# Altium schematic sheet Sheet.SchDoc
size A2 portrait; Organization: Altium Limited; Address1: L3, 12a Rodborough Rd; Address2: Frenchs Forest; Address3: NSW; Address4: Australia 2086
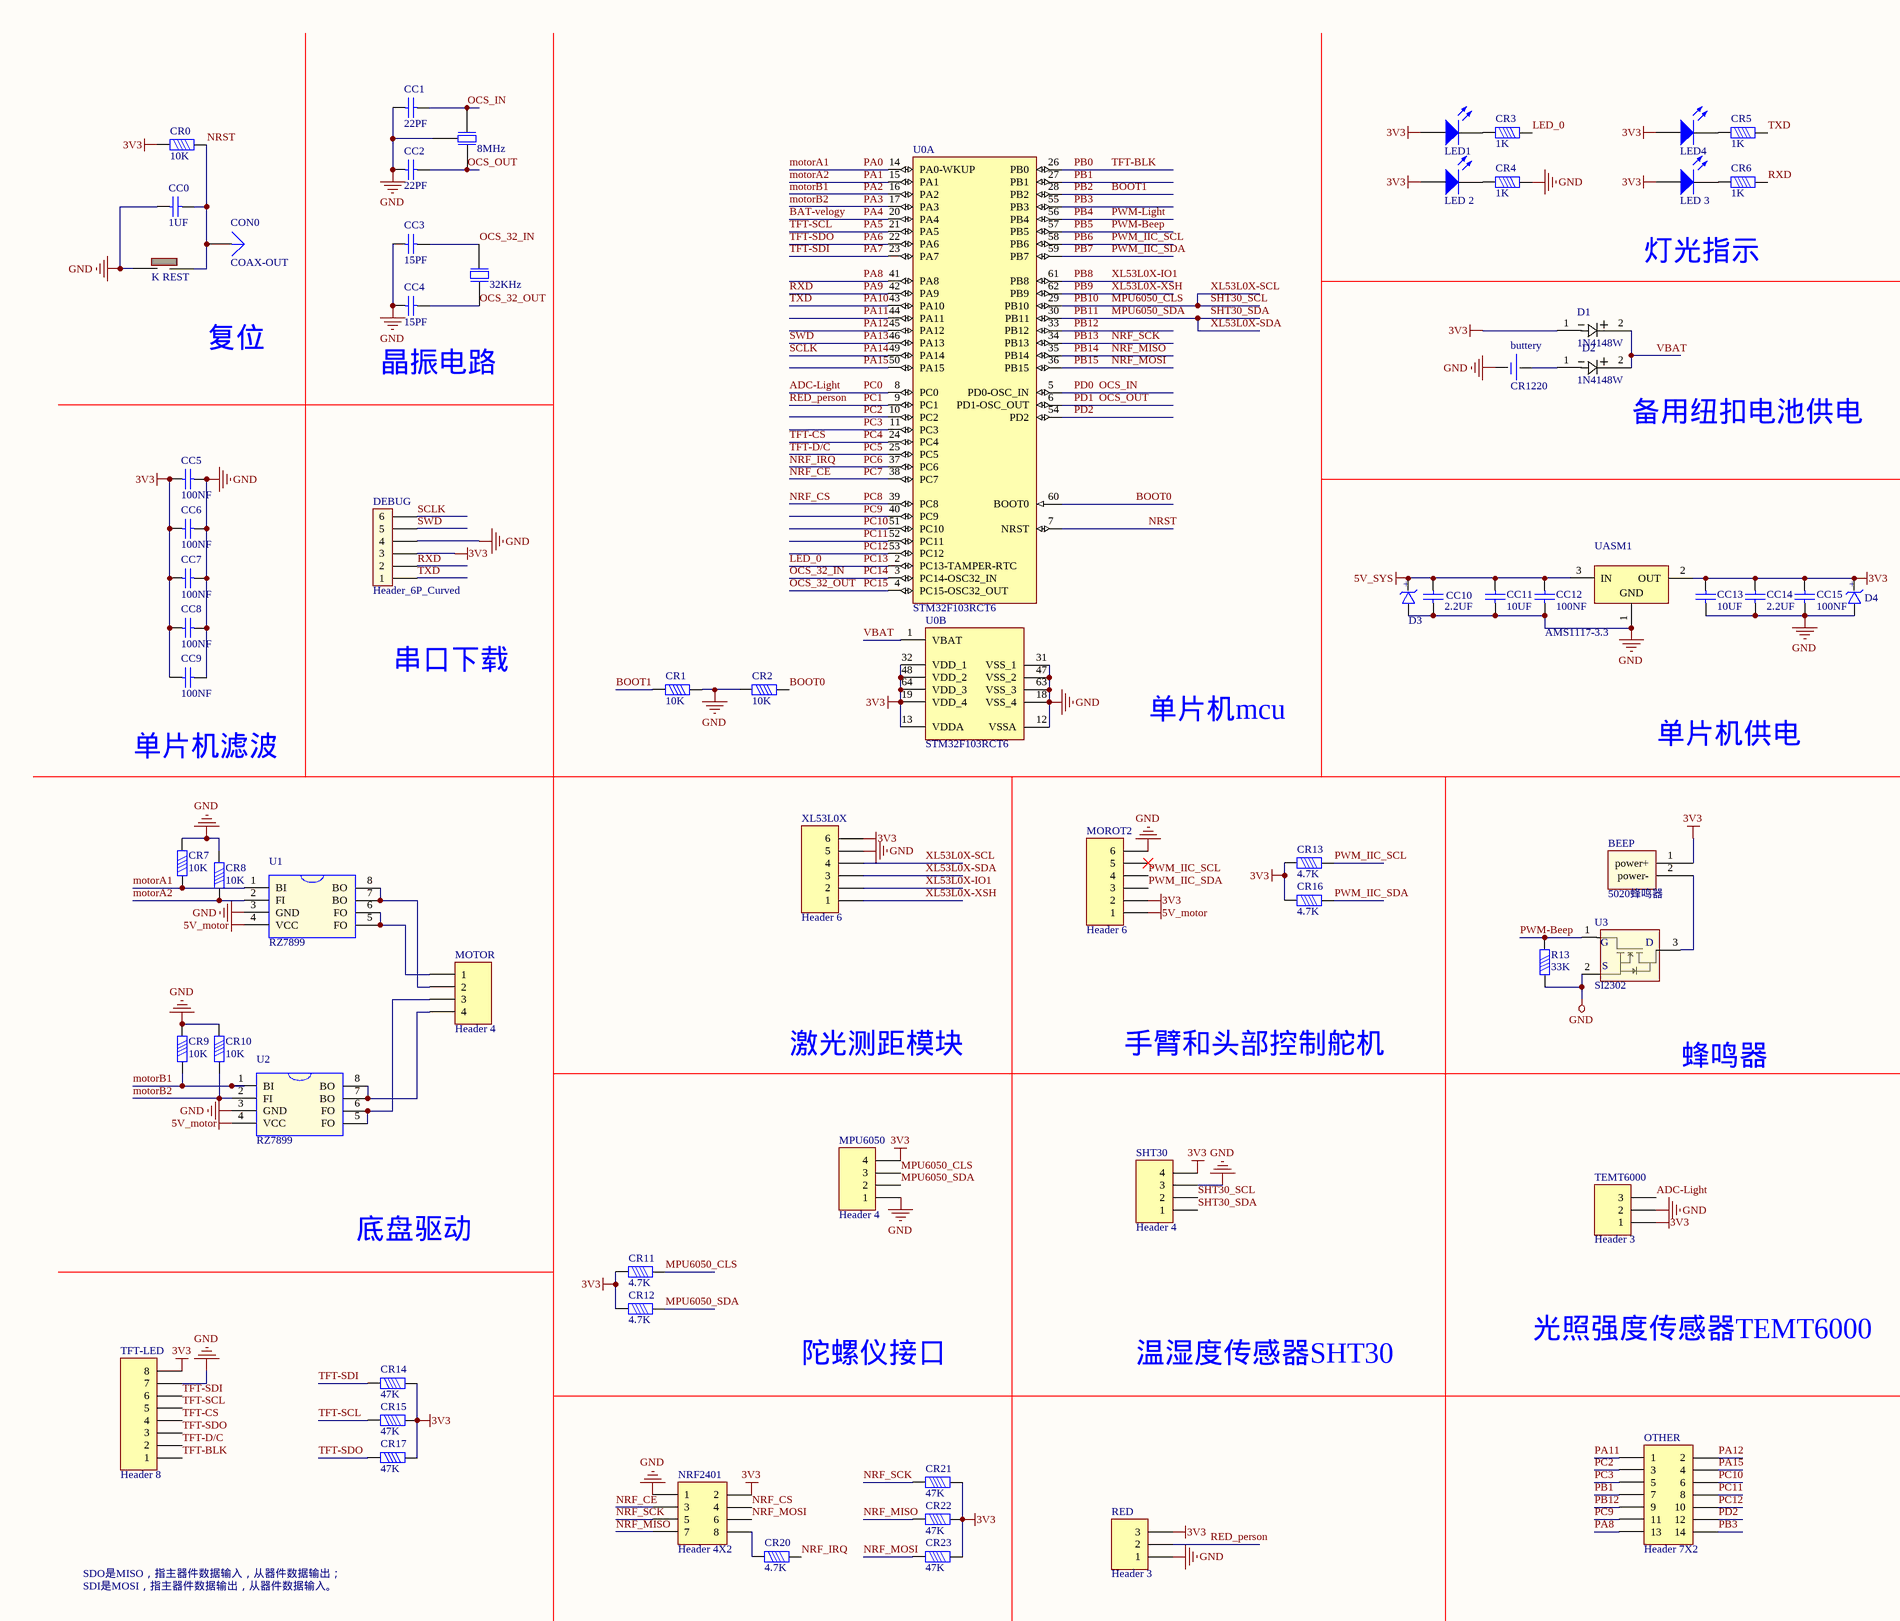
[diagram p0: Sheet.SchDoc, top left]
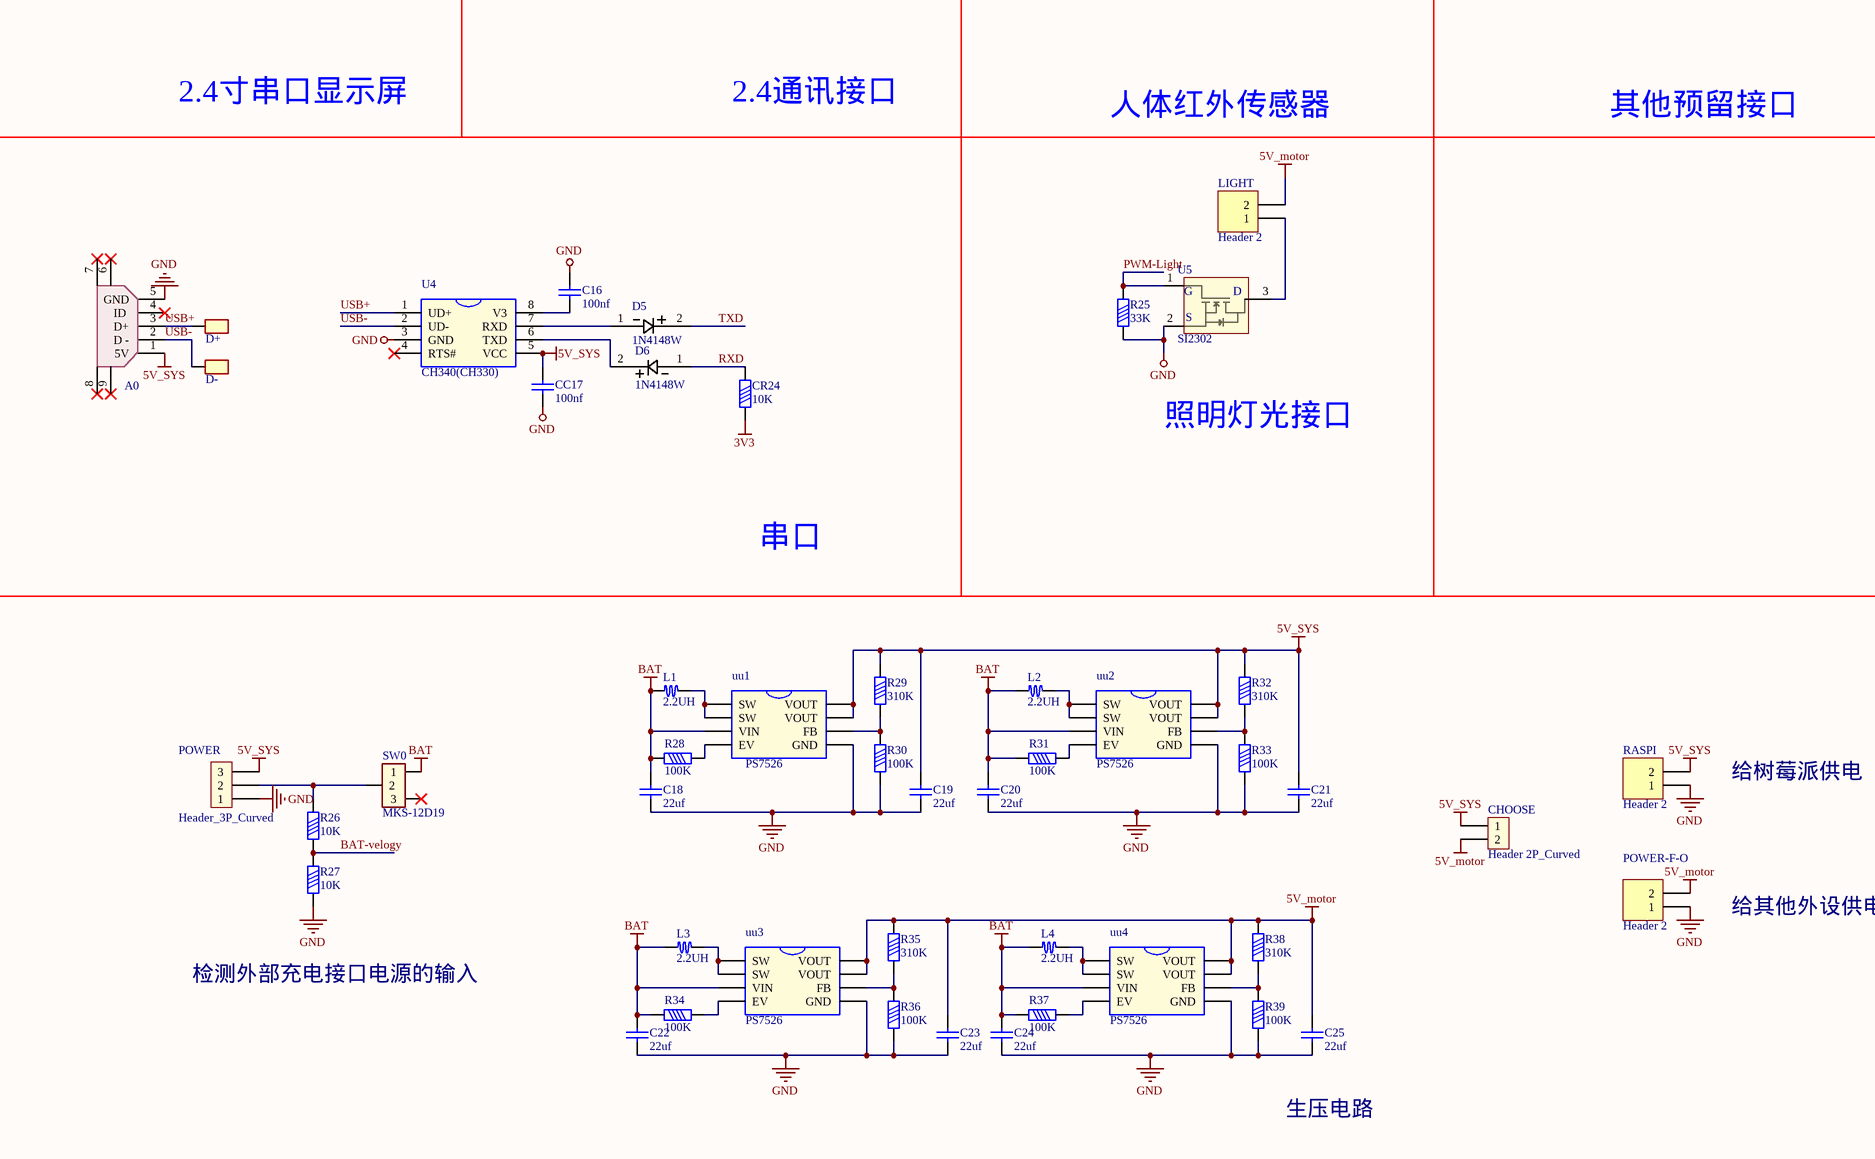
[diagram p1: Sheet.SchDoc, bottom left]

## Parts
8MHz  XTAL 3225 8M  [T 3225]  (value not drawn)
32KHz  XTAL 3215 32.768kKHz  [T 3215]  (value not drawn)
A0  Micro USB  [Micro USB]  (value not drawn)
BEEP  5020蜂鸣器  [5020蜂鸣器]
buttery  CR1220  [CR1220-buttery]
C16  value 100nf  [CC1608-0603]  (hidden comment: Cap Chip 0603)
C18  value 22uf  [CC2012-0805]  (hidden comment: Cap Chip 0805)
C19  value 22uf  [CC2012-0805]  (hidden comment: Cap Chip 0805)
C20  value 22uf  [CC2012-0805]  (hidden comment: Cap Chip 0805)
C21  value 22uf  [CC2012-0805]  (hidden comment: Cap Chip 0805)
C22  value 22uf  [CC2012-0805]  (hidden comment: Cap Chip 0805)
C23  value 22uf  [CC2012-0805]  (hidden comment: Cap Chip 0805)
C24  value 22uf  [CC2012-0805]  (hidden comment: Cap Chip 0805)
C25  value 22uf  [CC2012-0805]  (hidden comment: Cap Chip 0805)
CC0  value 1UF  [CC1608-0603]  (hidden comment: Cap Chip 0603)
CC1  value 22PF  [CC1608-0603]  (hidden comment: Cap Chip 0603)
CC2  value 22PF  [CC1608-0603]  (hidden comment: Cap Chip 0603)
CC3  value 15PF  [CC1608-0603]  (hidden comment: Cap Chip 0603)
CC4  value 15PF  [CC1608-0603]  (hidden comment: Cap Chip 0603)
CC5  value 100NF  [CC1608-0603]  (hidden comment: Cap Chip 0603)
CC6  value 100NF  [CC1608-0603]  (hidden comment: Cap Chip 0603)
CC7  value 100NF  [CC1608-0603]  (hidden comment: Cap Chip 0603)
CC8  value 100NF  [CC1608-0603]  (hidden comment: Cap Chip 0603)
CC9  value 100NF  [CC1608-0603]  (hidden comment: Cap Chip 0603)
CC10  value 2.2UF  [CC1608-0603]  (hidden comment: Cap Chip 0603)
CC11  value 10UF  [CC1608-0603]  (hidden comment: Cap Chip 0603)
CC12  value 100NF  [CC1608-0603]  (hidden comment: Cap Chip 0603)
CC13  value 10UF  [CC1608-0603]  (hidden comment: Cap Chip 0603)
CC14  value 2.2UF  [CC1608-0603]  (hidden comment: Cap Chip 0603)
CC15  value 100NF  [CC1608-0603]  (hidden comment: Cap Chip 0603)
CC17  value 100nf  [CC1608-0603]  (hidden comment: Cap Chip 0603)
CHOOSE  Header 2P_Curved  [Header_2_54_2PW]
CON0  COAX-OUT  [PIN1]
CR0  value 10K  [CR1608-0603]  (hidden comment: Resistor Chip 0603)
CR1  value 10K  [CR1608-0603]  (hidden comment: Resistor Chip 0603)
CR2  value 10K  [CR1608-0603]  (hidden comment: Resistor Chip 0603)
CR3  value 1K  [CR1608-0603]  (hidden comment: Resistor Chip 0603)
CR4  value 1K  [CR1608-0603]  (hidden comment: Resistor Chip 0603)
CR5  value 1K  [CR1608-0603]  (hidden comment: Resistor Chip 0603)
CR6  value 1K  [CR1608-0603]  (hidden comment: Resistor Chip 0603)
CR7  value 10K  [CR1608-0603]  (hidden comment: Resistor Chip 0603)
CR8  value 10K  [CR1608-0603]  (hidden comment: Resistor Chip 0603)
CR9  value 10K  [CR1608-0603]  (hidden comment: Resistor Chip 0603)
CR10  value 10K  [CR1608-0603]  (hidden comment: Resistor Chip 0603)
CR11  value 4.7K  [CR1608-0603]  (hidden comment: Resistor Chip 0603)
CR12  value 4.7K  [CR1608-0603]  (hidden comment: Resistor Chip 0603)
CR13  value 4.7K  [CR1608-0603]  (hidden comment: Resistor Chip 0603)
CR14  value 47K  [CR1608-0603]  (hidden comment: Resistor Chip 0603)
CR15  value 47K  [CR1608-0603]  (hidden comment: Resistor Chip 0603)
CR16  value 4.7K  [CR1608-0603]  (hidden comment: Resistor Chip 0603)
CR17  value 47K  [CR1608-0603]  (hidden comment: Resistor Chip 0603)
CR20  value 4.7K  [CR1608-0603]  (hidden comment: Resistor Chip 0603)
CR21  value 47K  [CR1608-0603]  (hidden comment: Resistor Chip 0603)
CR22  value 47K  [CR1608-0603]  (hidden comment: Resistor Chip 0603)
CR23  value 47K  [CR1608-0603]  (hidden comment: Resistor Chip 0603)
CR24  value 10K  [CR1608-0603]  (hidden comment: Resistor Chip 0603)
D1  1N4148W  [SOD-123]
D2  1N4148W  [SOD-123]
D3  SMBJ3.3A  [DO214AA(SMB)]  (value not drawn)
D4  SMBJ3.3A  [DO214AA(SMB)]  (value not drawn)
D5  1N4148W  [SOD-123]
D6  1N4148W  [SOD-123]
D+  H0  [header 1]  (value not drawn)
D-  H0  [header 1]  (value not drawn)
DEBUG  Header_6P_Curved  [Header_2_54_6PW]
K_REST  KEY 3*4  [KEY 3*4]  (value not drawn)
L1  2.2UH  [Inductor-1040]
L2  2.2UH  [Inductor-1040]
L3  2.2UH  [Inductor-1040]
L4  2.2UH  [Inductor-1040]
LED1  LED Chip  [CLED1608-0603]  (value not drawn)
LED4  LED Chip  [CLED1608-0603]  (value not drawn)
LED_2  LED Chip  [CLED1608-0603]  (value not drawn)
LED_3  LED Chip  [CLED1608-0603]  (value not drawn)
LIGHT  Header 2  [HX2.54-2]
MOROT2  Header 6  [HX2.54-6]
MOTOR  Header 4  [HX2.54-4]
MPU6050  Header 4  [HX2.54-4]
NRF2401  Header 4X2  [HDR2X4]
OTHER  Header 7X2  [HDR2X7]
POWER  Header_3P_Curved  [Header_2_54_3PW]
POWER-F-O  Header 2  [HX2.54-2]
R13  value 33K  [CR1608-0603]  (hidden comment: Resistor Chip 0603)
R25  value 33K  [CR1608-0603]  (hidden comment: Resistor Chip 0603)
R26  value 10K  [CR1608-0603]  (hidden comment: Resistor Chip 0603)
R27  value 10K  [CR1608-0603]  (hidden comment: Resistor Chip 0603)
R28  value 100K  [CR1608-0603]  (hidden comment: Resistor Chip 0603)
R29  value 310K  [CR1608-0603]  (hidden comment: Resistor Chip 0603)
R30  value 100K  [CR1608-0603]  (hidden comment: Resistor Chip 0603)
R31  value 100K  [CR1608-0603]  (hidden comment: Resistor Chip 0603)
R32  value 310K  [CR1608-0603]  (hidden comment: Resistor Chip 0603)
R33  value 100K  [CR1608-0603]  (hidden comment: Resistor Chip 0603)
R34  value 100K  [CR1608-0603]  (hidden comment: Resistor Chip 0603)
R35  value 310K  [CR1608-0603]  (hidden comment: Resistor Chip 0603)
R36  value 100K  [CR1608-0603]  (hidden comment: Resistor Chip 0603)
R37  value 100K  [CR1608-0603]  (hidden comment: Resistor Chip 0603)
R38  value 310K  [CR1608-0603]  (hidden comment: Resistor Chip 0603)
R39  value 100K  [CR1608-0603]  (hidden comment: Resistor Chip 0603)
RASPI  Header 2  [HX2.54-2]
RED  Header 3  [HX2.54-3]
SHT30  Header 4  [HX2.54-4]
SW0  MKS-12D19  [SW  MKS 12D19]
TEMT6000  Header 3  [HX2.54-3]
TFT-LED  Header 8  [HX2.54-8]
U0  STM32F103RCT6  [STM-LQFP64_N]  (parts A,B of 2)
U1  RZ7899  [SOP8]
U2  RZ7899  [SOP8]
U3  SI2302  [SOT-23 SI2302]
U4  CH340(CH330)  [SOP8]
U5  SI2302  [SOT-23 SI2302]
UASM1  AMS1117-3.3  [SOT-223]
uu1  PS7526  [ESOP8]
uu2  PS7526  [ESOP8]
uu3  PS7526  [ESOP8]
uu4  PS7526  [ESOP8]
XL53L0X  Header 6  [HX2.54-6]

## Nets
3V3: BEEP.1(power+) CC5.1 CC6.1 CC7.1 CC8.1 CC9.1 CC13.2 CC14.2 CC15.2 CR0.1 CR11.1 CR12.1 CR13.1 CR14.2 CR15.2 CR16.1 CR17.2 CR21.2 CR22.2 CR23.2 CR24.1 D1.1 D4.1 DEBUG.3 LED1.1(A) LED4.1(A) LED_2.1(A) LED_3.1(A) MOROT2.2 MPU6050.4 NRF2401.2 RED.3 SHT30.4 TEMT6000.1 TFT-LED.8 U0.13(VDDA) U0.19(VDD_4) U0.32(VDD_1) U0.48(VDD_2) U0.64(VDD_3) UASM1.2(OUT) XL53L0X.6
5V_motor: C23.1 C25.1 CHOOSE.2 LIGHT.2 MOROT2.1 POWER-F-O.2 R35.1 R38.1 U1.4(VCC) U2.4(VCC) uu3.7(VOUT) uu3.8(VOUT) uu4.7(VOUT) uu4.8(VOUT)
5V_SYS: A0.1(5V) C19.1 C21.1 CC10.2 CC11.2 CC12.2 CC17.2 CHOOSE.1 D3.1 POWER.3 R29.1 R32.1 RASPI.2 U4.5(VCC) UASM1.3(IN) uu1.7(VOUT) uu1.8(VOUT) uu2.7(VOUT) uu2.8(VOUT)
BAT: C18.1 C20.1 C22.1 C24.1 L1.1 L2.1 L3.1 L4.1 R28.1 R31.1 R34.1 R37.1 SW0.1 uu1.3(VIN) uu2.3(VIN) uu3.3(VIN) uu4.3(VIN)
GND: 8MHz.3(GND) A0.5(GND) buttery.2 C16.1 C18.2 C19.2 C20.2 C21.2 C22.2 C23.2 C24.2 C25.2 CC0.1 CC1.1 CC2.1 CC3.1 CC4.1 CC5.2 CC6.2 CC7.2 CC8.2 CC9.2 CC10.1 CC11.1 CC12.1 CC13.1 CC14.1 CC15.1 CC17.1 CR1.2 CR2.1 CR4.2 CR7.2 CR8.2 CR9.1 CR10.1 D3.2 D4.2 DEBUG.4 K_REST.1 MOROT2.6 MPU6050.1 NRF2401.1 POWER.1 POWER-F-O.1 R13.1 R25.1 R27.2 R30.2 R33.2 R36.2 R39.2 RASPI.1 RED.1 SHT30.3 TEMT6000.2 TFT-LED.7 U0.12(VSSA) U0.18(VSS_4) U0.31(VSS_1) U0.47(VSS_2) U0.63(VSS_3) U1.3(GND) U2.3(GND) U3.2(SOURCE) U4.3(GND) U5.2(SOURCE) UASM1.1(GND) uu1.5(GND) uu2.5(GND) uu3.5(GND) uu4.5(GND) XL53L0X.5
ADC-Light: TEMT6000.3 U0.8(PC0)  [also labelled PC0]
BAT-velogy: R26.1 R27.1 U0.20(PA4)  [also labelled PA4]
BOOT0: CR2.2 U0.60(BOOT0)
BOOT1: CR1.1 U0.28(PB2)  [also labelled PB2]
LED_0: CR3.2 U0.2(PC13-TAMPER-RTC)  [also labelled PC13]
motorA1: CR7.1 U0.14(PA0-WKUP) U1.1(BI)  [also labelled PA0]
motorA2: CR8.1 U0.15(PA1) U1.2(FI)  [also labelled PA1]
motorB1: CR9.2 U0.16(PA2) U2.1(BI)  [also labelled PA2]
motorB2: CR10.2 U0.17(PA3) U2.2(FI)  [also labelled PA3]
MPU6050_CLS: CR11.2 MPU6050.3 SHT30.2 U0.29(PB10) XL53L0X.4  [also labelled PB10, SHT30_SCL, XL53L0X-SCL]
MPU6050_SDA: CR12.2 MPU6050.2 SHT30.1 U0.30(PB11) XL53L0X.3  [also labelled PB11, SHT30_SDA, XL53L0X-SDA]
NRF_CE: NRF2401.3 U0.38(PC7)  [also labelled PC7]
NRF_CS: NRF2401.4 U0.39(PC8)  [also labelled PC8]
NRF_IRQ: CR20.2 U0.37(PC6)  [also labelled PC6]
NRF_MISO: CR22.1 NRF2401.7 U0.35(PB14)  [also labelled PB14]
NRF_MOSI: CR23.1 NRF2401.6 U0.36(PB15)  [also labelled PB15]
NRF_SCK: CR21.1 NRF2401.5 U0.34(PB13)  [also labelled PB13]
NRST: CC0.2 CON0.1(A) CR0.2 K_REST.2 U0.7(NRST)
OCS_32_IN: 32KHz.2(OSC2) CC3.2 U0.3(PC14-OSC32_IN)  [also labelled PC14]
OCS_32_OUT: 32KHz.1(OSC1) CC4.2 U0.4(PC15-OSC32_OUT)  [also labelled PC15]
OCS_IN: 8MHz.1(OSC1) CC1.2 U0.5(PD0-OSC_IN)  [also labelled PD0]
OCS_OUT: 8MHz.2(OSC2) CC2.2 U0.6(PD1-OSC_OUT)  [also labelled PD1]
PA5: CR15.1 TFT-LED.5 U0.21(PA5)  [also labelled TFT-SCL]
PA6: CR17.1 TFT-LED.3 U0.22(PA6)  [also labelled TFT-SDO]
PA7: CR14.1 TFT-LED.6 U0.23(PA7)  [also labelled TFT-SDI]
PA8: OTHER.13 U0.41(PA8)
PA9: CR6.2 CR24.2 D6.1 DEBUG.2 U0.42(PA9)  [also labelled RXD]
PA10: CR5.2 D5.2 DEBUG.1 U0.43(PA10)  [also labelled TXD]
PA11: OTHER.1 U0.44(PA11)
PA12: OTHER.2 U0.45(PA12)
PA13: DEBUG.5 U0.46(PA13)  [also labelled SWD]
PA14: DEBUG.6 U0.49(PA14)  [also labelled SCLK]
PA15: OTHER.4 U0.50(PA15)
PB0: TFT-LED.1 U0.26(PB0)  [also labelled TFT-BLK]
PB1: OTHER.7 U0.27(PB1)
PB3: OTHER.14 U0.55(PB3)
PB4: R25.2 U0.56(PB4) U5.1(GATE)  [also labelled PWM-Light]
PB5: R13.2 U0.57(PB5) U3.1(GATE)  [also labelled PWM-Beep]
PB6: CR13.2 MOROT2.4 U0.58(PB6)  [also labelled PWM_IIC_SCL]
PB7: CR16.2 MOROT2.3 U0.59(PB7)  [also labelled PWM_IIC_SDA]
PB8: U0.61(PB8) XL53L0X.2  [also labelled XL53L0X-IO1]
PB9: U0.62(PB9) XL53L0X.1  [also labelled XL53L0X-XSH]
PB12: OTHER.9 U0.33(PB12)
PC1: RED.2 U0.9(PC1)  [also labelled RED_person]
PC2: OTHER.3 U0.10(PC2)
PC3: OTHER.5 U0.11(PC3)
PC4: TFT-LED.4 U0.24(PC4)  [also labelled TFT-CS]
PC5: TFT-LED.2 U0.25(PC5)  [also labelled TFT-D/C]
PC9: OTHER.11 U0.40(PC9)
PC10: OTHER.6 U0.51(PC10)
PC11: OTHER.8 U0.52(PC11)
PC12: OTHER.10 U0.53(PC12)
PD2: OTHER.12 U0.54(PD2)
USB+: A0.3(D+) D+.1 U4.1(UD+)
USB-: A0.2(D_-) D-.1 U4.2(UD-)
VBAT: D1.2 D2.2 U0.1(VBAT)
NetBEEP_2: BEEP.2(power-) U3.3(DRAIN)
Netbuttery_1: buttery.1 D2.1
NetC16_2: C16.2 U4.8(V3)
NetCR3_1: CR3.1 LED1.2(K)
NetCR4_1: CR4.1 LED_2.2(K)
NetCR5_1: CR5.1 LED4.2(K)
NetCR6_1: CR6.1 LED_3.2(K)
NetCR20_1: CR20.1 NRF2401.8
NetD5_1: D5.1 U4.7(RXD)
NetD6_2: D6.2 U4.6(TXD)
NetL1_2: L1.2 uu1.1(SW) uu1.2(SW)
NetL2_2: L2.2 uu2.1(SW) uu2.2(SW)
NetL3_2: L3.2 uu3.1(SW) uu3.2(SW)
NetL4_2: L4.2 uu4.1(SW) uu4.2(SW)
NetLIGHT_1: LIGHT.1 U5.3(DRAIN)
NetMOTOR_1: MOTOR.1 U1.5(FO) U1.6(FO)
NetMOTOR_2: MOTOR.2 U1.7(BO) U1.8(BO)
NetMOTOR_3: MOTOR.3 U2.5(FO) U2.6(FO)
NetMOTOR_4: MOTOR.4 U2.7(BO) U2.8(BO)
NetPOWER_2: POWER.2 R26.2 SW0.2
NetR28_2: R28.2 uu1.4(EV)
NetR29_2: R29.2 R30.1 uu1.6(FB)
NetR31_2: R31.2 uu2.4(EV)
NetR32_2: R32.2 R33.1 uu2.6(FB)
NetR34_2: R34.2 uu3.4(EV)
NetR35_2: R35.2 R36.1 uu3.6(FB)
NetR37_2: R37.2 uu4.4(EV)
NetR38_2: R38.2 R39.1 uu4.6(FB)

Not connected (* = marked no-connect by the designer): A0 4(ID_)* 6* 7* 8* 9*; MOROT2 5*; SW0 3*; U4 4(RTS#)*

## Notes on the sheet
- 灯光指示
- 复位
- (near CC4) 晶振电路
- (near D2) 备用纽扣电池供电
- 串口下载
- 单片机mcu
- 单片机滤波
- 单片机供电
- 激光测距模块
- 手臂和头部控制舵机
- 蜂鸣器
- 底盘驱动
- 光照强度传感器TEMT6000
- 陀螺仪接口
- 温湿度传感器SHT30
- SDO是MISO，指主器件数据输入，从器件数据输出；
- SDI是MOSI，指主器件数据输出，从器件数据输入。
- 2.4寸串口显示屏
- 2.4通讯接口
- 人体红外传感器
- 其他预留接口
- 照明灯光接口
- 串口
- 给树莓派供电
- 给其他外设供电
- 检测外部充电接口电源的输入
- 生压电路
- Title
- Size:
- Date:
- File:
- A2
- Number:
- Time:
- Revision:
- Sheet
- of
- (in symbol SI2302) G; D; S
- (in symbol SMBJ3.3A) +

## Library data of the parts
BEEP = 5020蜂鸣器: 蜂鸣器，贴片封装，长宽5.2mm
buttery = CR1220: 纽扣电池
C16 CC0-CC15 CC17 = Cap Chip 0603: Polarized Capacitor (Radial); Published: 8-Jun-2000; Revision: July-2002: Re-released for DXP Platform.; Publisher: Altium Limited
C18-C25 = Cap Chip 0805: Polarized Capacitor (Radial); Published: 8-Jun-2000; Revision: July-2002: Re-released for DXP Platform.; Publisher: Altium Limited
CHOOSE = Header 2P_Curved: 弯的2P排针
CON0 = COAX-OUT: Coax-M Connector; Revision: 17-Jul-2002: Re-released for DXP Platform.; Publisher: Altium Limited
CR0-CR17 CR20-CR24 R13 R25-R39 = Resistor Chip 0603: Resistor; Published: 8-Jun-2000; Revision: July-2002: Re-released for DXP Platform.; Publisher: Altium Limited
D1 D2 D5 D6 = 1N4148W: 开关二极管 贴片 1N4148W 1206/SOD-123 丝印T4 150MA 75V
D3 D4 = SMBJ3.3A: 3.3V稳压管，缓解瞬间电压冲击
D+ D- = header 1
DEBUG = Header_6P_Curved: 弯的6P排针
L1-L4 = Inductor: 圆柱线圈的贴片电感
LED1 LED4 LED_2 LED_3 = LED Chip: Typical Chip LED; Published: 8-Jun-2000; Revision: July-2002: Re-released for DXP Platform.; Publisher: Altium Limited
LIGHT POWER-F-O RASPI = Header 2: Header, 2-Pin; LatestRevisionDate: 17-Jul-2002; LatestRevisionNote: Re-released for DXP Platform.; Publisher: Altium Limited
MOROT2 XL53L0X = Header 6: Header, 6-Pin; LatestRevisionDate: 17-Jul-2002; LatestRevisionNote: Re-released for DXP Platform.; Publisher: Altium Limited
MOTOR MPU6050 SHT30 = Header 4: Header, 4-Pin; LatestRevisionDate: 17-Jul-2002; LatestRevisionNote: Re-released for DXP Platform.; Publisher: Altium Limited
NRF2401 = Header 4X2: Header, 4-Pin, Dual row; LatestRevisionDate: 17-Jul-2002; LatestRevisionNote: Re-released for DXP Platform.; Publisher: Altium Limited
OTHER = Header 7X2: Header, 7-Pin, Dual row; LatestRevisionDate: 17-Jul-2002; LatestRevisionNote: Re-released for DXP Platform.; Publisher: Altium Limited
POWER = Header_3P_Curved: 弯的3P排针
RED TEMT6000 = Header 3: Header, 3-Pin; LatestRevisionDate: 17-Jul-2002; LatestRevisionNote: Re-released for DXP Platform.; Publisher: Altium Limited
SW0 = sw-MSK-12D19
TFT-LED = Header 8: Header, 8-Pin; LatestRevisionDate: 17-Jul-2002; LatestRevisionNote: Re-released for DXP Platform.; Publisher: Altium Limited
U0 = STM32F103RCT6: ARM Cortex-M3 32-bit MCU, 256 KB Flash, 48 KB Internal RAM, 51 I/Os, 64-pin LQFP, -40 to 85 degC, Tray; A/D Converter: 3x12-bit (16 Channel); D/A Converter: 2x12-bit (2 Channel); FLASH Size (Prog) (kB): 256; I/Os (High Current): 51; Internal RAM Size (kB): 48; Operating Frequency(F) (Processor speed) (MHz): 72; Supply Voltage(Vcc) min (V): 2; DatasheetVersion: Rev. 8; PackageVersion: Rev. 4, 06/2013; PackageReference: LQFP64; PackageDescription: 64-Pin Low Profile Quad Flat Package, 10 x 10 mm Body, 0.5 mm Pitch; Supplier 1: Digi-Key; Supplier Part Number 1: 497-9033-ND; Supplier 2: Newark; Supplier Part Number 2: 01P4099; Supplier 3: Newark; Supplier Part Number 3: 57P1227; Supplier 4: Mouser; Supplier Part Number 4: 511-STM32F103RCT6; Core: ARM Cortex-M3; Packing: Tray; Mounting Technology: Surface Mount; PartNumber: STM32F103RCT6; ComponentLink1Description: Manufacturer URL; ComponentLink1URL: http://www.st.com/web/en/home.html; ComponentLink2Description: Datasheet; ComponentLink2URL: http://www.st.com/st-web-ui/static/active/en/resource/technical/document/datasheet/CD00191185.pdf; ComponentLink3Description: Package Specification; ComponentLink3URL: http://www.st.com/st-web-ui/static/active/en/resource/technical/document/datasheet/DM00037051.pdf
U1 U2 = RZ7899: 电机驱动:输入支持3V-25V，输出支持6A
U3 U5 = SI2302: NMOS场效应MOS管 SOT-23
U4 = CH340(CH330): USB转串口rs232的芯片，内置晶振
UASM1 = AMS1117: POSITIVE OUTPUT VOLTAGE
uu1-uu4 = PS7526: 3.7V升压输出5V2A/2.4A，(3V,3.3V.3.7V升压输出5V2A/2.4A，PS7526超高效率的同步整流升压方案。实际应用足2.4A。)PS7526超高效率的同步整流升压方案。实际应用足2.4A。